# EAGLE design full (EAGLE 8.2.2)
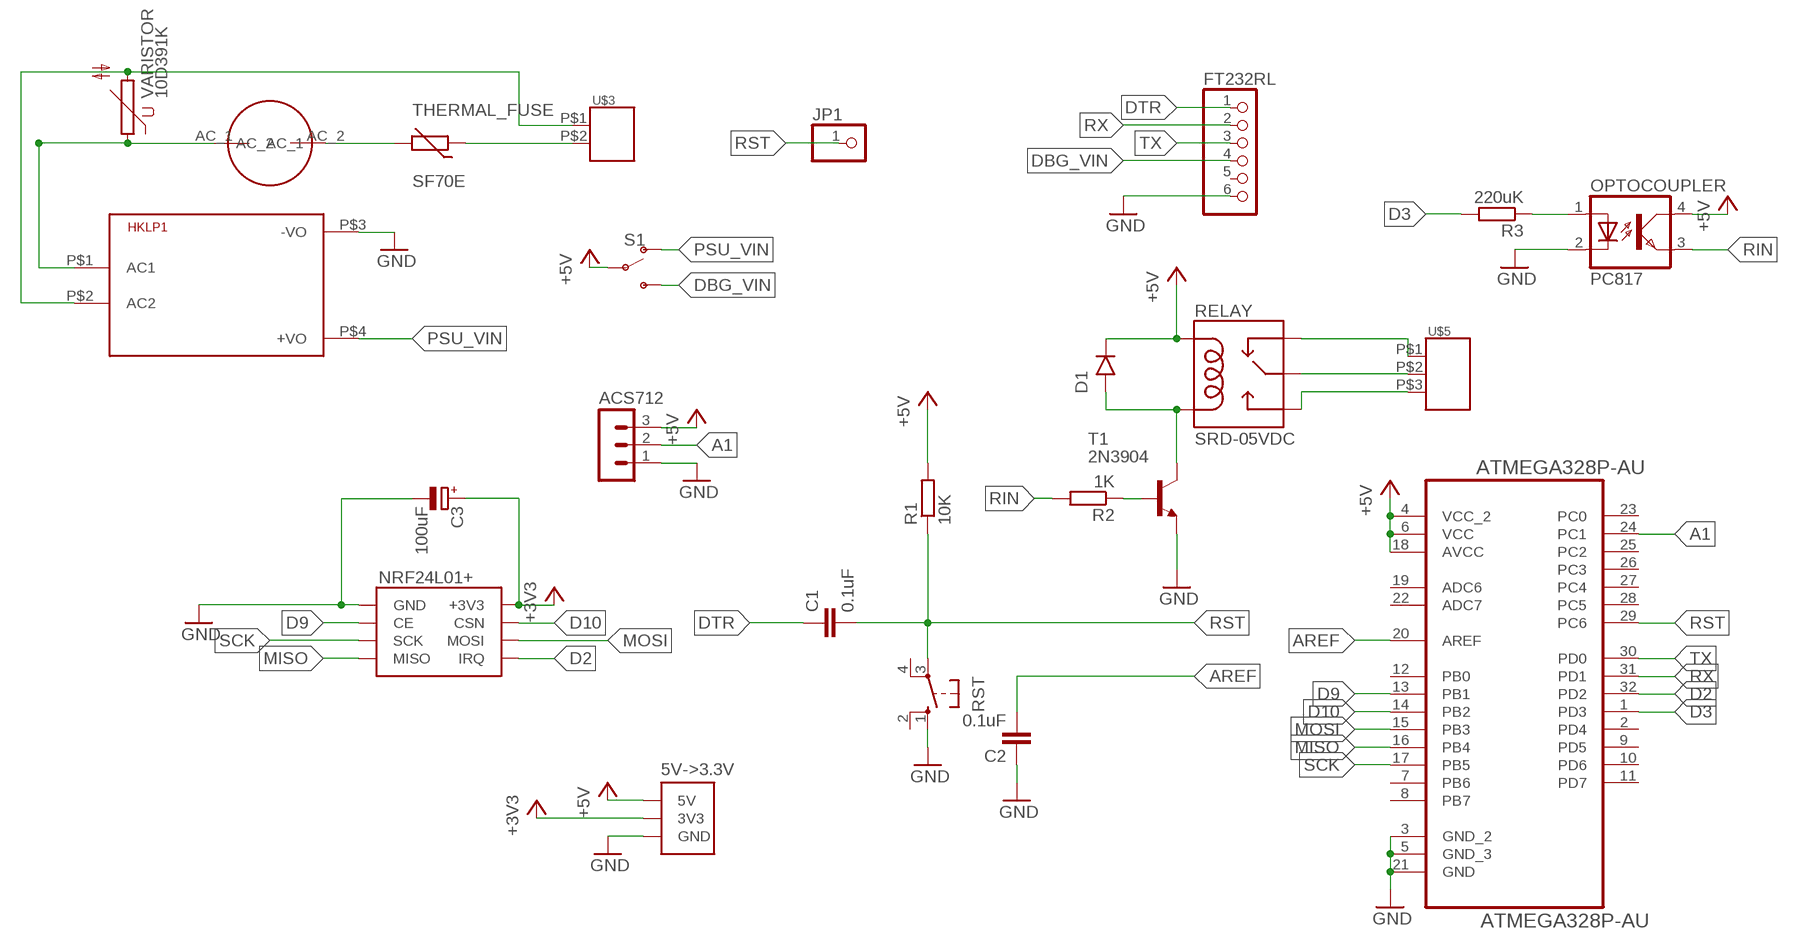
[diagram p0: schematic, sheet 1]

## Parts
5V->3.3V  AMS1117_VERT  [AMS1117_VERT]
ACS712  MA03-1  [MA03-1]
ATMEGA328P-AU  ATMEGA328P-AU  [QFP80P900X900X120-32N]
C1  0.1uF  C-EU050-030X075  [C050-030X075]
C2  0.1uF  C-EU050-030X075  [C050-030X075]
C3  100uF  CPOL-EUE2.5-6  [E2,5-6]
D1  1N4001  [DO41-10]
FT232RL  PINHD-1X6  [1X06]
FUSE  R3-24  [R3-24]
HKLP1  HKLPM01  [HKLPM01]
JP1  PINHD-1X1  [1X01]
NRF24L01+  RADIO_NRF24L1  [NRF24L1]
OPTOCOUPLER  PC817  [DIL04]
R1  10K  R-EU_0204/5  [0204/5]
R2  1K  R-EU_0204/5  [0204/5]
R3  220uK  R-EU_0204/5  [0204/5]
RELAY  SRD-05VDC  RELAYPTH  [SRD-05VDC-SL-C]
RST  10-XX  [B3F-10XX]
S1  SWITCH-SPDT-PTH-11.6X4.0MM  [SWITCH_SPDT_PTH_11.6X4.0MM]
T1  2N3904  [TO92]
THERMAL_FUSE  SF70E  THERMISTOR_R-7,5  [R-7,5]
U$3  CONNECTOR_2SCREW  [SCREW_2]
U$5  CONNECTOR_3SCREW  [SCREW_3]
VARISTOR  10D391K  S10K385  [S10K385]

## Nets
+3V3: 5V->3.3V.3V3 C3.+ NRF24L01+.+3V3
+5V: 5V->3.3V.5V ACS712.3 ATMEGA328P-AU.4(VCC_2) ATMEGA328P-AU.6(VCC) ATMEGA328P-AU.18(AVCC) D1.C(CATHODE) OPTOCOUPLER.4(COL) R1.2 RELAY.COIL1 S1.2(P)
A1: ACS712.2 ATMEGA328P-AU.24(PC1)
AC1_F: FUSE.AC_1 HKLP1.P$1(AC1) VARISTOR.1
AC2: HKLP1.P$2(AC2) U$3.P$1 VARISTOR.2
AREF: ATMEGA328P-AU.20(AREF) C2.2
D2: ATMEGA328P-AU.32(PD2) NRF24L01+.IRQ
D3: ATMEGA328P-AU.1(PD3) R3.2
D9: ATMEGA328P-AU.13(PB1) NRF24L01+.CE
D10: ATMEGA328P-AU.14(PB2) NRF24L01+.CSN
DBG_VIN: FT232RL.4 S1.3(S)
DTR: C1.1 FT232RL.1
FU_IN: FUSE.AC_2 THERMAL_FUSE.2
GND: 5V->3.3V.GND ACS712.1 ATMEGA328P-AU.3(GND_2) ATMEGA328P-AU.5(GND_3) ATMEGA328P-AU.21(GND) C2.1 C3.- FT232RL.6 HKLP1.P$3(-VO) NRF24L01+.GND OPTOCOUPLER.2(C) RST.1(S) T1.3(E)
MISO: ATMEGA328P-AU.16(PB4) NRF24L01+.MISO
MOSI: ATMEGA328P-AU.15(PB3) NRF24L01+.MOSI
OPTO_IN: OPTOCOUPLER.1(A) R3.1
PSU_VIN: HKLP1.P$4(+VO) S1.1(O)
R_CENTER: RELAY.SWCOMMON U$5.P$2
R_IN: D1.A(ANODE) RELAY.COIL0 T1.1(C)
R_LEFT: RELAY.SWOPEN U$5.P$3
R_RIGHT: RELAY.SWCLOSED(SWCLOSE) U$5.P$1
RIN: OPTOCOUPLER.3(EMIT) R2.2
RST: ATMEGA328P-AU.29(PC6) C1.2 JP1.1 R1.1 RST.3(P)
RX: ATMEGA328P-AU.31(PD1) FT232RL.2
SCK: ATMEGA328P-AU.17(PB5) NRF24L01+.SCK
T_IN: R2.1 T1.2(B)
TR_IN: THERMAL_FUSE.1 U$3.P$2
TX: ATMEGA328P-AU.30(PD0) FT232RL.3
Unconnected: ATMEGA328P-AU.2(PD4) ATMEGA328P-AU.7(PB6) ATMEGA328P-AU.8(PB7) ATMEGA328P-AU.9(PD5) ATMEGA328P-AU.10(PD6) ATMEGA328P-AU.11(PD7) ATMEGA328P-AU.12(PB0) ATMEGA328P-AU.19(ADC6) ATMEGA328P-AU.22(ADC7) ATMEGA328P-AU.23(PC0) ATMEGA328P-AU.25(PC2) ATMEGA328P-AU.26(PC3) ATMEGA328P-AU.27(PC4) ATMEGA328P-AU.28(PC5) FT232RL.5 RST.2(S1) RST.4(P1)

## Library data of the parts
5V->3.3V = TD-MySensors:AMS1117_VERT
ACS712 = con-lstb:MA03-1: PIN HEADER; OC_FARNELL: unknown; OC_NEWARK: unknown
ATMEGA328P-AU = Atmel_By_element14_Batch_1-00:ATMEGA328P-AU: 8-bit Microcontroller with In-System Programmable Flash; MPN: ATMEGA328P-AU; OC_FARNELL: 1715486; OC_NEWARK: 14R4631; PACKAGE: TQFP-32; SUPPLIER: Atmel
C1 C2 = rcl:C-EU: CAPACITOR, European symbol
C3 = rcl:CPOL-EU: POLARIZED CAPACITOR, European symbol
D1 = tango:1N4001: DIODE general purpose rectifier, 1 A
FT232RL = pinhead:PINHD-1X6: PIN HEADER
FUSE = mylib:R3-24
HKLP1 = HKLPM01:HKLPM01
JP1 = pinhead:PINHD-1X1: PIN HEADER
NRF24L01+ = TD-MySensors:RADIO_NRF24L1
OPTOCOUPLER = optocoupler:PC817: SHARP OPTO COUPLER; MPN: PC817X4J000F; OC_FARNELL: 9707727; OC_NEWARK: 97K7059
R1-R3 = rcl:R-EU_: RESISTOR, European symbol
RELAY = SRD-05VDC-SL-C:RELAY: SPDT relay (COM-00101)
RST = switch-omron:10-XX: OMRON SWITCH; MPN: B3F-1000; OC_FARNELL: 176432; OC_NEWARK: 36M3542
S1 = SparkFun-Switches:SWITCH-SPDT: Single Pole, Double Throw (SPDT) Switch Single-pole, double-throw (SPDT) switch. Variant Overview SMD-AYZ0202 Surface Mount DPDT Switch <https://www.sparkfun.com/products/597> (COM-00597) Used on e.g. LilyPad Arduino USB - ATmega32U4 Board <https://www.sparkfun.com/products/12049> PTH-11.6X4.0MM SPDT Mini Power Switch <https://www.sparkfun.com/products/102> (COM-00102) Used on e.g. SparkFun Simon Says - Through-Hole Soldering Kit <https://www.sparkfun.com/products/10547> (KIT-10547) PTH-11.6X4.0MM-KIT KIT version of SPDT Mini Power Switch - Simplifies soldering by removing tStop of switch pins - only one side can be soldered. PTH-11.6X4.0MM-LOCK LOCK version of SPDT Mini Power Switch - Offset pins hold switch in place for easier soldering. SMD-RIGHT-ANGLE Surface Mount Right Angle Switch <https://www.sparkfun.com/products/10860> (COM-10860) Used on e.g. SparkFun ESP8266 Thing <https://www.sparkfun.com/products/13231>; PROD_ID: SWCH-08261; SF_SKU: COM-00102
T1 = transistor:2N3904: NPN TRANSISTOR
THERMAL_FUSE = discrete:THERMISTOR_: Thermo Resistor
U$3 = TD-MySensors:CONNECTOR_2: 2 Pin connector
U$5 = TD-MySensors:CONNECTOR_3
VARISTOR = varistor:S10K385: VARISTOR

## Net classes
0 default: width 0.35 mm, drill 1 mm, clearance 0.3 mm

## Board
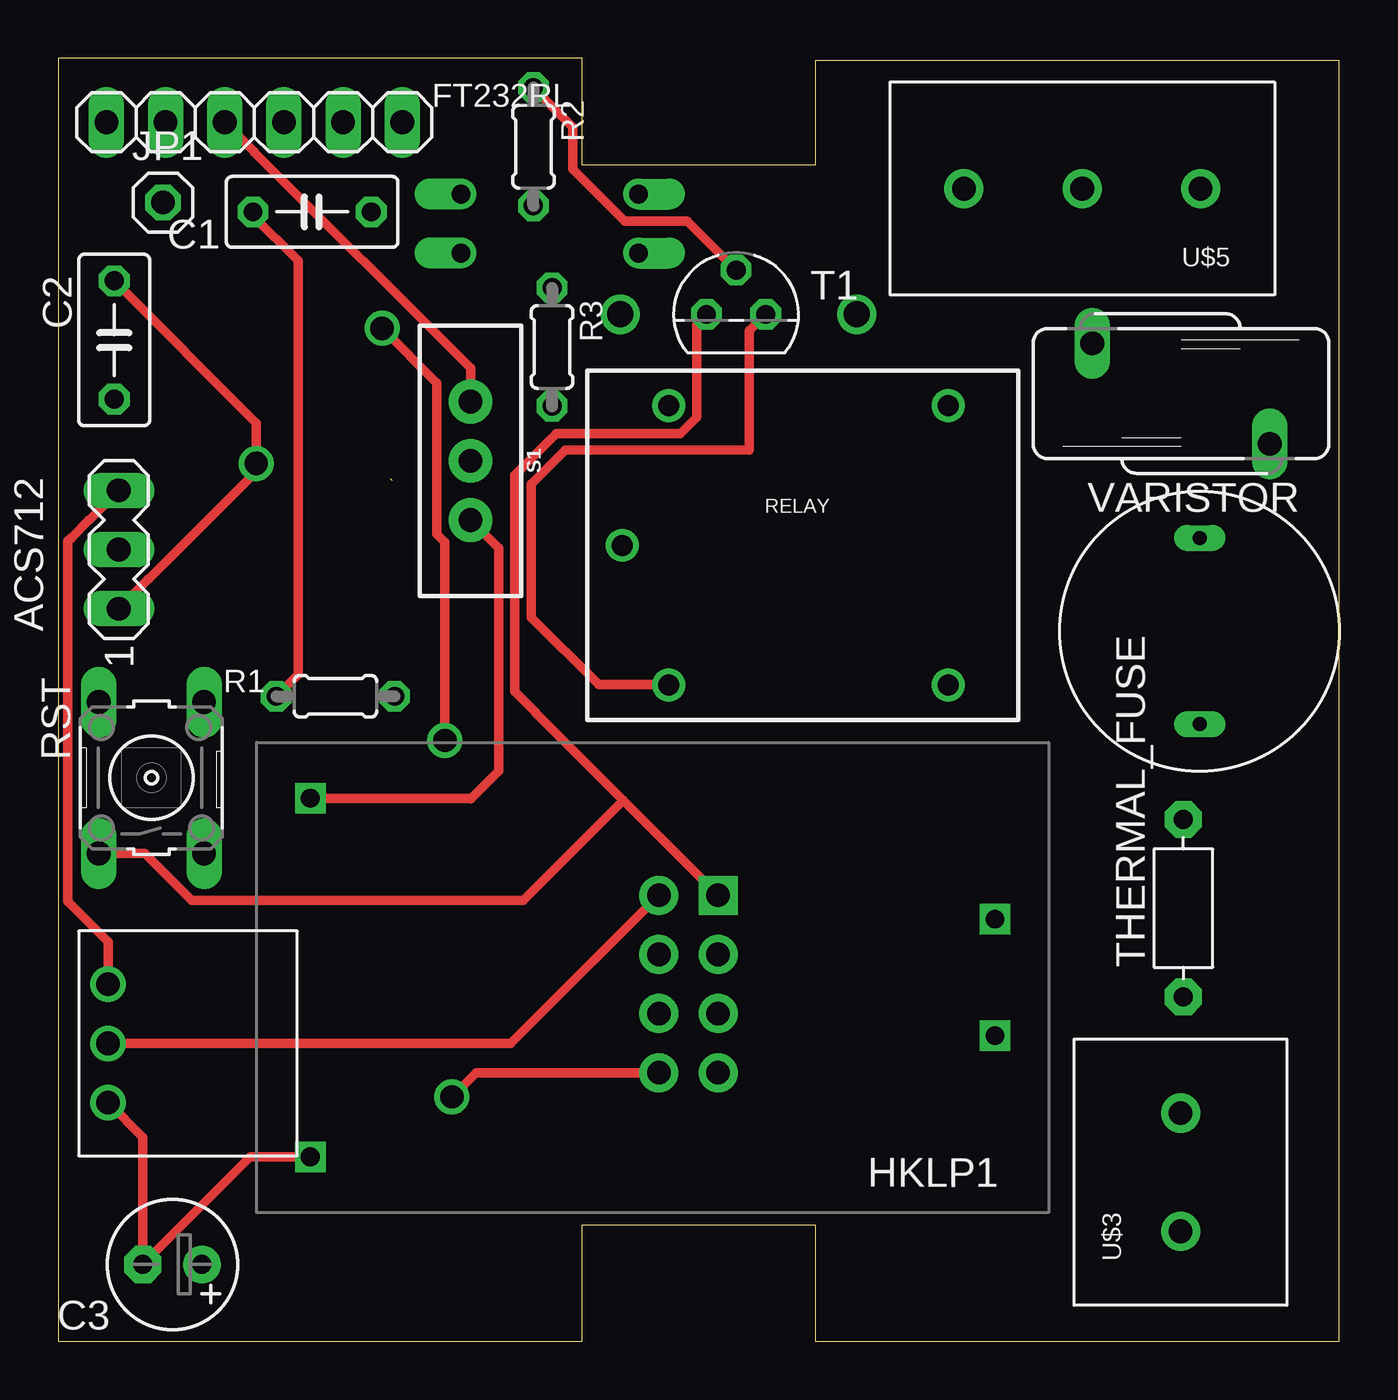
[diagram p1: board, top side]
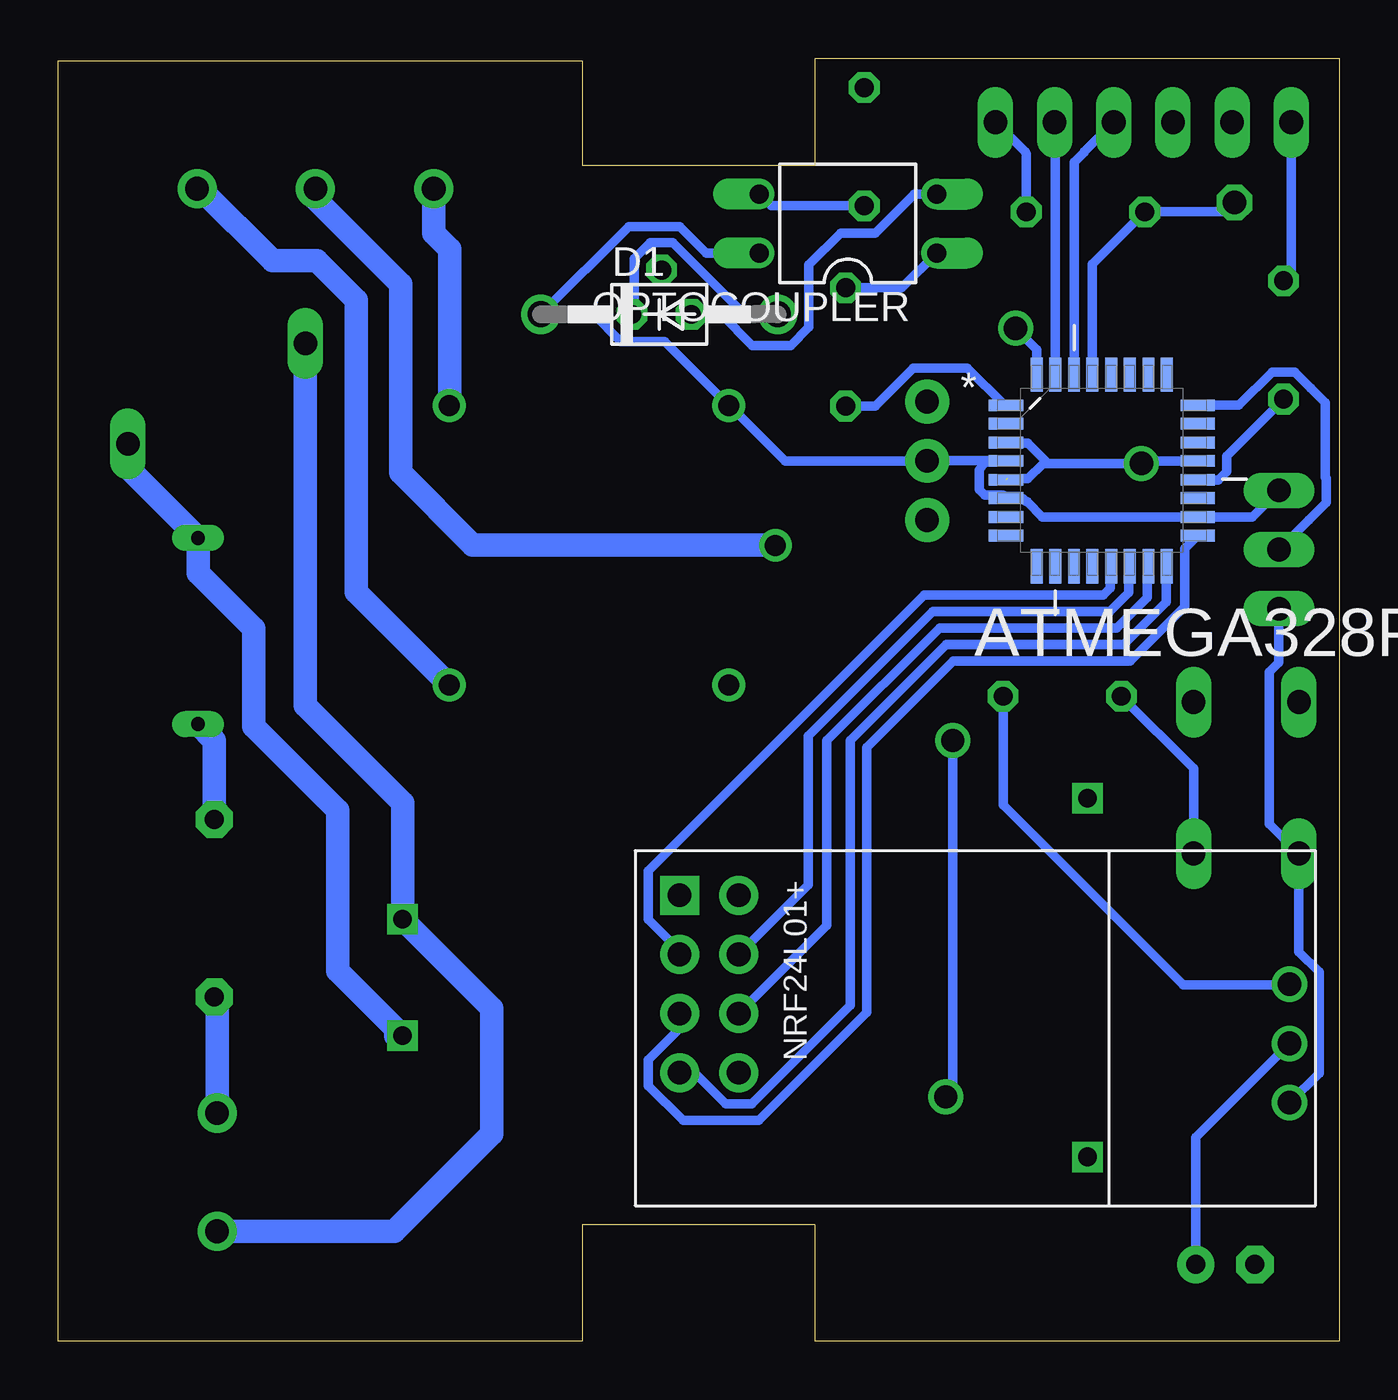
[diagram p2: board, bottom side, seen from below]

Size 55 x 55.1 mm. Coordinates in mm from the lower left corner, seen from the top.
Outline: 0,0 22.5,0 22.5,5 32.5,5 32.5,0 55,0 55,55 32.5,55 32.5,50.5 22.5,50.5 22.5,55.1 0,55.1 0,0
Copper layers (1*16): Top 0.035mm / dielectric 1.5mm / Bottom 0.035mm
Design rules "default *": minimum track width 10mil, minimum drill 24mil, track to track 8mil, track to pad 8mil, pad to pad 8mil, via to via 8mil, smd to smd 8mil, copper to edge 8mil, drill to drill 8mil, minimum pad ring 10mil, minimum via ring 8mil, stop-mask expansion 4mil, vias tented up to drill 0mil, thermal gap 10mil

### Footprints (pad centres in the part's own frame; a part is rotated, then mirrored left to right if it is on the bottom)
AMS1117_VERT = drill 1.016: 3V3 0,-1.27; 5V -2.54,-1.27; GND 2.54,-1.27
MA03-1 = drill 1.016 long: 1 -2.54,0; 2 0,0; 3 2.54,0
QFP80P900X900X120-32N = smd 1.473 x 0.508: 1 -4.115,2.794; 2 -4.115,2.007; 3 -4.115,1.194; 4 -4.115,0.406; 5 -4.115,-0.406; 6 -4.115,-1.194; 7 -4.115,-2.007; 8 -4.115,-2.794; 17 4.115,-2.794; 18 4.115,-2.007; 19 4.115,-1.194; 20 4.115,-0.406; 21 4.115,0.406; 22 4.115,1.194; 23 4.115,2.007; 24 4.115,2.794 | smd 0.508 x 1.473: 9 -2.794,-4.115; 10 -2.007,-4.115; 11 -1.194,-4.115; 12 -0.406,-4.115; 13 0.406,-4.115; 14 1.194,-4.115; 15 2.007,-4.115; 16 2.794,-4.115; 25 2.794,4.115; 26 2.007,4.115; 27 1.194,4.115; 28 0.406,4.115; 29 -0.406,4.115; 30 -1.194,4.115; 31 -2.007,4.115; 32 -2.794,4.115
C050-030X075 = drill 0.813 octagon: 1 -2.54,0; 2 2.54,0
E2,5-6 = drill 0.813 pad 1.6: + -1.27,0 | drill 0.813 pad 1.6 octagon: - 1.27,0
DO41-10 = drill 1.118: A 5.08,0; C -5.08,0
1X06 = drill 1.016 long: 1 -6.35,0; 2 -3.81,0; 3 -1.27,0; 4 1.27,0; 5 3.81,0; 6 6.35,0
R3-24 = drill 0.6 pad 1.016 long: AC_1 -4,0; AC_2 4,0
HKLPM01 = drill 0.8 square: P$1 -14.7,2.5; P$2 -14.7,-2.5; P$3 14.7,7.7; P$4 14.7,-7.7
1X01 = drill 1.016 octagon: 1 0,0
NRF24L1 = drill 1.016 pad 1.676: +3V3 -5.715,-9.525; CE -3.175,-12.065; CSN -3.175,-9.525; IRQ 1.905,-9.525; MISO 1.905,-12.065; MOSI -0.635,-9.525; SCK -0.635,-12.065 | drill 1.016 pad 1.676 square: GND -5.715,-12.065
DIL04 = drill 0.813 offset: 1 -1.27,-3.81; 2 1.27,-3.81; 3 1.27,3.81; 4 -1.27,3.81
0204/5 = drill 0.813 octagon: 1 -2.54,0; 2 2.54,0
SRD-05VDC-SL-C = drill 0.9: COIL0 -5.39,-6.12; COIL1 -5.39,5.88; SWCLOSED 6.61,-6.12; SWCOMMON -7.39,-0.12; SWOPEN 6.61,5.88
B3F-10XX = drill 1.016 long: 1 -3.251,2.261; 2 3.251,2.261; 3 -3.251,-2.261; 4 3.251,-2.261
SWITCH_SPDT_PTH_11.6X4.0MM = drill 1.016 pad 1.88: 1 0,2.54; 2 0,0; 3 0,-2.54
TO92 = drill 0.813 octagon: 1 1.27,0; 2 0,1.905; 3 -1.27,0
R-7,5 = drill 0.813 pad 1.6 octagon: 1 -3.81,0; 2 3.81,0
SCREW_2 = drill 1.016 pad 1.676: P$1 -2.54,0; P$2 2.54,0
SCREW_3 = drill 1.016 pad 1.676: P$1 -2.54,0; P$2 2.54,0; P$3 7.62,0
S10K385 = drill 1.016 long: 1 -2.159,-3.81; 2 2.159,3.81

### Placement (x,y rotation side)
5V->3.3V  3.41,12.79 270 top
ACS712  2.6,34 90 top
ATMEGA328P-AU  10.2,37.4 0 bottom
C1  10.9,48.5 180 top
C2  2.4,43 270 top
C3  4.9,3.3 180 top
D1  29.2,44.1 0 bottom
FT232RL  8.42,52.35 180 top
FUSE  49,30.5 270 top
HKLP1  25.52,15.62 180 top
JP1  4.5,48.9 0 top
NRF24L01+  16.26,13.44 270 bottom
OPTOCOUPLER  21.1,48 90 bottom
R1  11.9,27.7 0 top
R2  20.4,51.3 270 top
R3  21.2,42.7 270 top
RELAY  31.6,34.3 0 top
RST  4,24.2 90 top
S1  17.7,37.81 180 top
T1  29.1,44.1 0 top
THERMAL_FUSE  48.3,18.6 90 top
U$3  48.18,7.26 90 top
U$5  46.5,49.5 180 top
VARISTOR  48.2,40.7 90 top

### Tracks (layer width: path | path; a pad name or v marks a point on that pad's centre or on a via)
+3V3
  Top 0.406: 5V->3.3V.3V3 19.42,12.79 NRF24L01+.+3V3
  Bottom 0.406: C3.+ 6.17,8.76 5V->3.3V.3V3
+5V
  Top 0.406: 5V->3.3V.5V 2.14,17.16 0.41,18.89 0.41,34.36 0.57,34.52 1.31,35.27 1.32,35.27 ACS712.3
  Bottom 0.406: 14.66,37.75 15.22,37.75 15.46,37.42 15.46,36.57 15.22,36.33 14.44,36.33 ATMEGA328P-AU.6 13.6,36.2 13.45,36.05 13.41,36.05 12.75,35.39 ATMEGA328P-AU.18 3.75,35.39 ACS712.3 | 14.66,37.75 14.47,37.75 ATMEGA328P-AU.4 | 14.66,37.75 14.72,37.81 S1.2 23.8,37.8 26.18,40.18 RELAY.COIL1 28.97,42.94 30.85,42.94 32.02,44.1 D1.C 30.5,47.88 28.32,47.88 27.18,46.73 OPTOCOUPLER.4 | R1.2 14.44,23.04 6.7,15.3 2.17,15.3 5V->3.3V.5V
A1
  Bottom 0.406: ATMEGA328P-AU.24 4.31,40.19 2.88,41.62 1.92,41.62 1.24,40.94 0.6,40.3 0.6,37.09 0.57,37.06 0.57,36.02 1.31,35.27 1.32,35.27 ACS712.2
AC1_F
  Bottom 1.016: 40.52,13.12 HKLP1.P$1 43,15.9 43,22.8 46.6,26.4 46.6,30.6 49,33 FUSE.AC_1 52.01,37.51 VARISTOR.1
AC2
  Bottom 1.016: VARISTOR.2 44.4,42.85 44.4,27.3 40.22,23.12 HKLP1.P$2 36.4,14.3 36.4,8.9 40.58,4.72 U$3.P$1
AREF
  Bottom 0.406: C2.2 4.84,38.02 4.84,37.34 5.2,36.99 ATMEGA328P-AU.20
D2  (via drill 1)
  Top 0.406: NRF24L01+.IRQ 17.93,11.54 v16.9,10.5 | v16.6,25.8 16.6,34.33 16.26,34.67 16.26,41.14 v13.9,43.5
  Bottom 0.406: ATMEGA328P-AU.32 12.99,42.59 v13.9,43.5 | v16.6,25.8 16.6,10.8 v16.9,10.5
D3
  Bottom 0.406: R3.2 19.93,40.16 18.3,41.79 15.97,41.79 14.38,40.19 ATMEGA328P-AU.1
D9
  Bottom 0.406: ATMEGA328P-AU.13 9.85,33.23 9.85,32.34 10.14,32.05 17.82,32.05 29.67,20.2 29.67,18.11 28.32,16.77 NRF24L01+.CE
D10
  Bottom 0.406: ATMEGA328P-AU.14 9.04,33.26 9.04,32.15 9.85,31.34 17.46,31.34 22.8,26 22.8,19.6 NRF24L01+.CSN
DBG_VIN
  Top 0.406: FT232RL.4 8.43,51.08 8.43,51.06 17.7,41.79 S1.3
DTR
  Bottom 0.406: C1.1 13.44,51.01 13.49,51.06 13.49,51.08 FT232RL.1
FU_IN
  Bottom 1.016: THERMAL_FUSE.2 48.3,25.8 FUSE.AC_2
GND  (via drill 1)  (1 unrouted)
  Top 0.406: T1.3 27.42,43.69 27.42,39.68 26.71,38.97 21.37,38.97 19.61,37.21 19.61,27.89 20.5,27 20.5,26.98 24.26,23.22 | 24.26,23.22 NRF24L01+.GND | C2.1 8.5,39.44 v8.5,37.7 8.5,37.35 3.89,32.73 3.88,32.73 ACS712.1 | HKLP1.P$3 8.25,7.92 C3.- 3.63,8.76 5V->3.3V.GND | RST.1 3.71,20.95 5.74,18.92 19.97,18.92 24.26,23.22
  Bottom 0.406: OPTOCOUPLER.2 18.24,49.27 19.92,47.6 21.41,47.6 22.78,46.23 22.78,43.54 23.56,42.76 25.21,42.76 26.55,44.1 T1.3 | FT232RL.6 2.07,45.87 C2.1 | ATMEGA328P-AU.21 8.39,37.81 v8.5,37.7 | ACS712.1 2.6,29.14 3,28.74 3,22.21 RST.1 1.74,16.72 0.88,15.85 0.88,15.2 0.88,11.52 5V->3.3V.GND | ATMEGA328P-AU.3 14.29,38.56 14.27,38.57 14.26,38.56 13.37,38.56 12.51,37.7 v8.5,37.7 | 14.27,37.04 14.26,37.05 13.37,37.05 12.72,37.7 v8.5,37.7
MISO
  Bottom 0.406: ATMEGA328P-AU.16 7.44,33.26 7.44,31.76 9.27,29.93 16.87,29.93 21,25.8 21,14.42 25.23,10.19 26.34,10.19 27.68,11.54 NRF24L01+.MISO
MOSI
  Bottom 0.406: ATMEGA328P-AU.15 8.25,33.23 8.25,31.94 9.56,30.63 17.17,30.63 22,25.8 22,17.86 NRF24L01+.MOSI
OPTO_IN
  Bottom 0.406: R3.1 18.78,45.24 OPTOCOUPLER.1
PSU_VIN
  Top 0.406: HKLP1.P$4 17.68,23.32 17.7,23.3 18.9,24.5 18.9,34.07 S1.1
R_CENTER
  Bottom 1.016: U$5.P$2 43.96,49.06 40.3,45.4 40.3,37.3 37.2,34.2 24.23,34.2 RELAY.SWCOMMON
R_IN
  Top 0.406: T1.1 29.67,43.4 29.67,38.27 21.77,38.27 20.31,36.81 20.31,31.09 23.2,28.2 26.19,28.2 RELAY.COIL0
  Bottom 0.406: D1.A 25.55,44.1 28.62,47.17 29.58,47.17 30.26,46.49 30.26,44.21 T1.1
R_LEFT
  Bottom 1.016: U$5.P$3 38.88,47.58 38.2,46.9 RELAY.SWOPEN
R_RIGHT
  Bottom 1.016: U$5.P$1 48.9,49.5 45.8,46.4 43.9,46.4 42.2,44.7 42.2,32.17 RELAY.SWCLOSED
RIN
  Bottom 0.406: R2.2 24.4,48.76 OPTOCOUPLER.3
RST
  Top 0.406: C1.2 8.36,48.34 10.3,46.4 10.3,28.64 R1.1
  Bottom 0.406: ATMEGA328P-AU.29 10.61,46.25 C1.2 4.9,48.5 JP1.1 | RST.3 6.26,24.6 R1.1
RX
  Bottom 0.406: ATMEGA328P-AU.31 12.21,52.33 FT232RL.2
SCK
  Bottom 0.406: ATMEGA328P-AU.17 6.65,34.04 6.65,31.55 8.97,29.22 16.58,29.22 20.29,25.51 20.29,14.13 24.94,9.49 28.17,9.49 29.67,10.98 29.67,12.09 28.32,13.43 NRF24L01+.SCK
T_IN
  Top 0.406: T1.2 27,48.11 24.32,48.11 22.09,50.33 22.09,52.15 R2.1
TR_IN
  Bottom 1.016: U$3.P$2 48.18,14.67 THERMAL_FUSE.1
TX
  Bottom 0.406: ATMEGA328P-AU.30 11.39,50.63 10.96,51.06 10.96,51.08 FT232RL.3